# EAGLE design akabeacon_square_type1 (EAGLE 7.2.0)
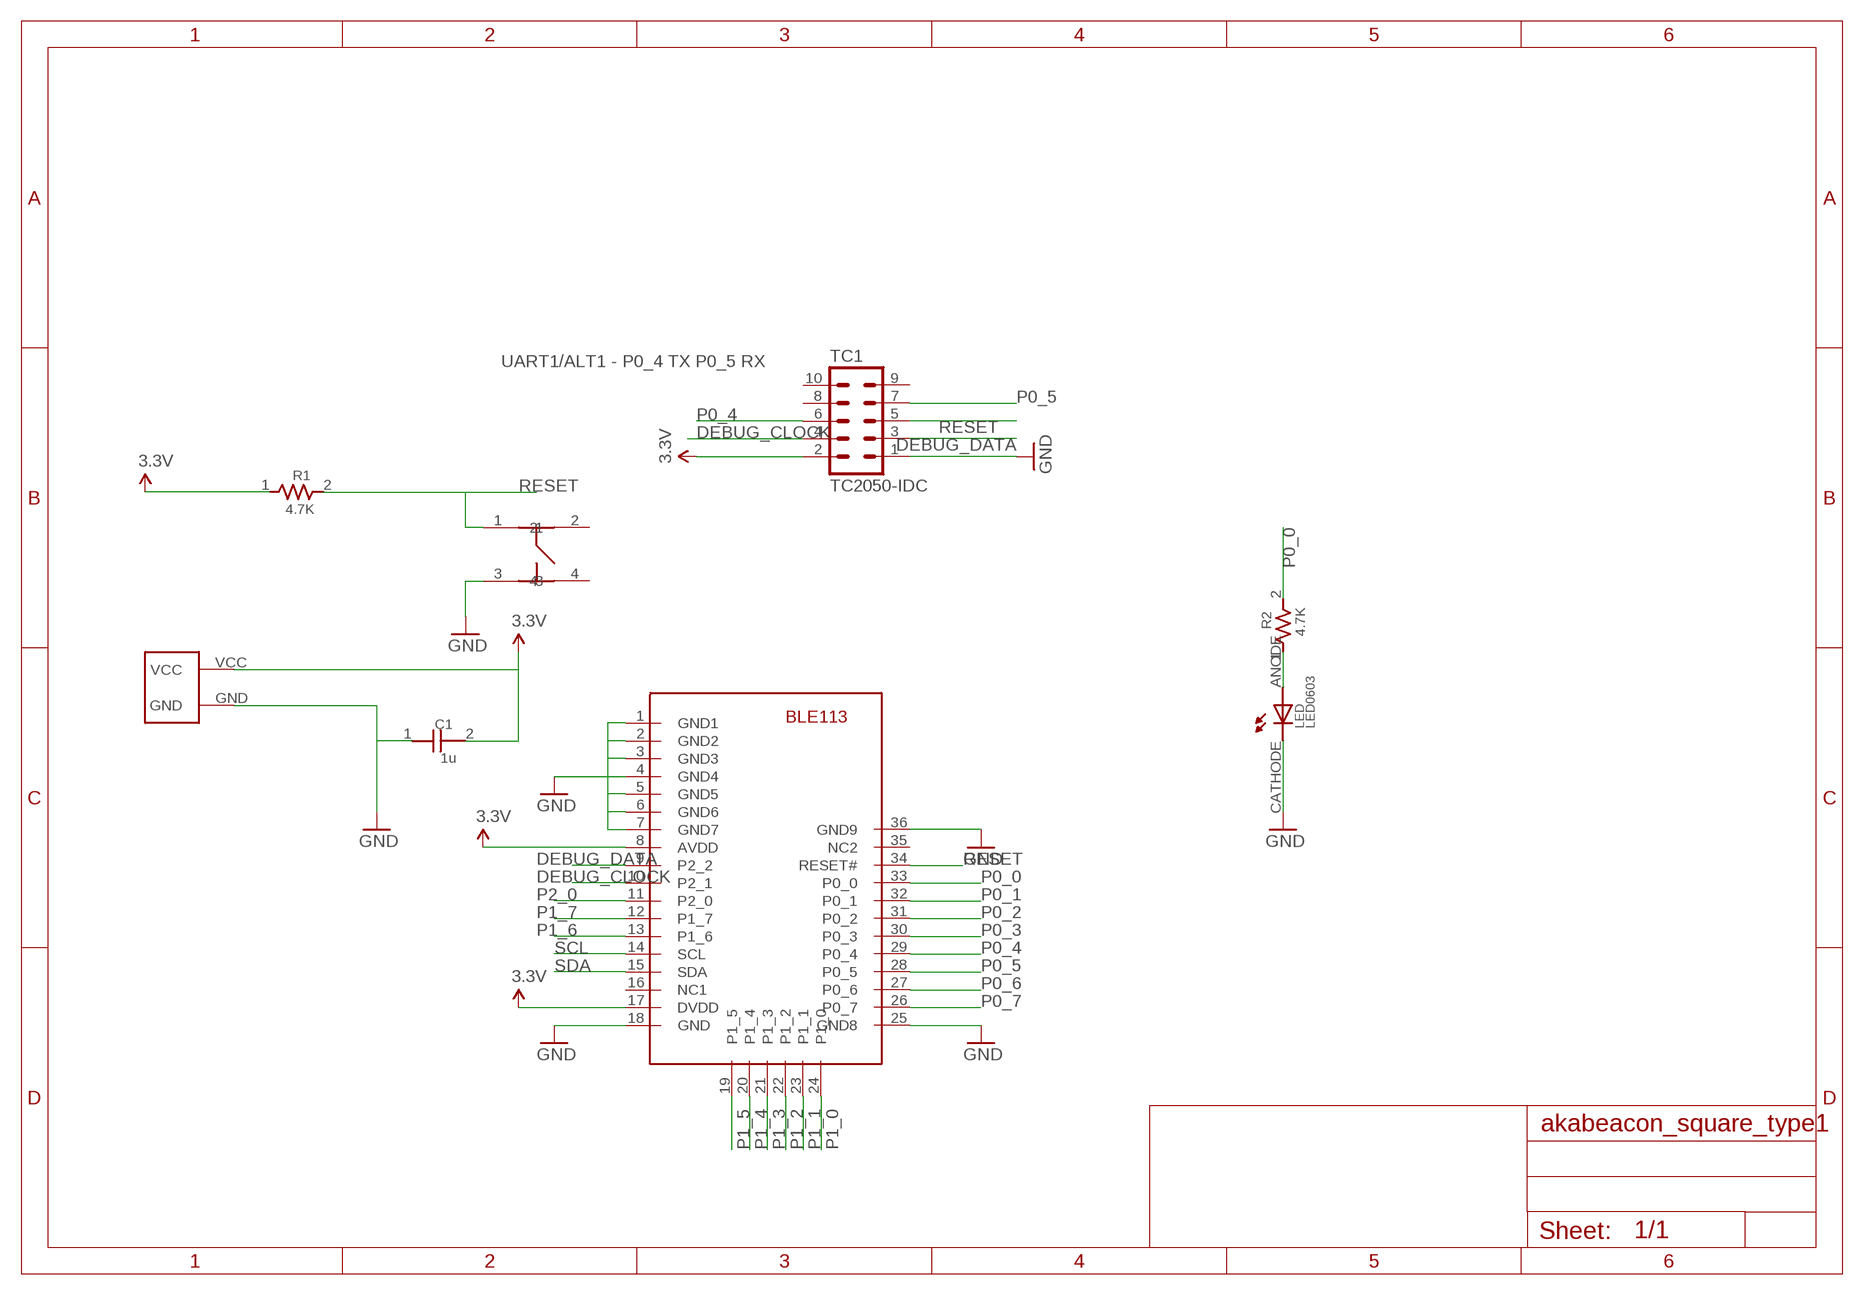
[diagram p0: schematic, sheet 1]

## Parts
C1  1u  CAPACITOR0603  [0603]
LED  LED0603  [0603]
R1  4.7K  RESISTOR0603  [0603]
R2  4.7K  RESISTOR0603  [0603]
TC1  TC2050-IDC  [TC2050-IDC-NL]
U$2  SQUARE-TYPE1  [SQUARE-TYPE1-TC2030]
U$5  BLE113  [BLE113]
U$6  SWICTH-4P(KMR2)  [SWITCH-4P(KMR2)]

## Nets
3.3V: C1.2 R1.1 TC1.2 U$2.VCC U$5.8(AVDD) U$5.17(DVDD)
DEBUG_CLOCK: TC1.4 U$5.10(P2_1)
DEBUG_DATA: TC1.3 U$5.9(P2_2)
GND: C1.1 LED.CATHODE TC1.1 U$2.GND U$5.1(GND1) U$5.2(GND2) U$5.3(GND3) U$5.4(GND4) U$5.5(GND5) U$5.6(GND6) U$5.7(GND7) U$5.18(GND) U$5.25(GND8) U$5.36(GND9) U$6.3
N$2: LED.ANODE R2.1
P0_0: R2.2 U$5.33(P0_0)
P0_1: U$5.32(P0_1)
P0_2: U$5.31(P0_2)
P0_3: U$5.30(P0_3)
P0_4: TC1.6 U$5.29(P0_4)
P0_5: TC1.7 U$5.28(P0_5)
P0_6: U$5.27(P0_6)
P0_7: U$5.26(P0_7)
P1_0: U$5.24(P1_0)
P1_1: U$5.23(P1_1)
P1_2: U$5.22(P1_2)
P1_3: U$5.21(P1_3)
P1_4: U$5.20(P1_4)
P1_5: U$5.19(P1_5)
P1_6: U$5.13(P1_6)
P1_7: U$5.12(P1_7)
P2_0: U$5.11(P2_0)
RESET: R1.2 TC1.5 U$5.34(RESET#) U$6.1
SCL: U$5.14(SCL)
SDA: U$5.15(SDA)
Unconnected: TC1.8 TC1.9 TC1.10 U$5.16(NC1) U$5.35(NC2) U$6.2 U$6.4

## Notes on the sheet
- UART1/ALT1 - P0_4 TX P0_5 RX

## Library data of the parts
C1 = GClue-Capacitor:CAPACITOR
LED = GClue-LED:LED
R1 R2 = GClue-Resistors:RESISTOR
TC1 = TagConnect:TC2050-IDC: Tag-Connect In Circuit Programming & Debug Cable 10 Pin http://www.tag-connect.com
U$2 = GClue-Beacon:SQUARE-TYPE1
U$5 = gclue:BLE113
U$6 = gclue:SWICTH-4P(KMR2)

## Board
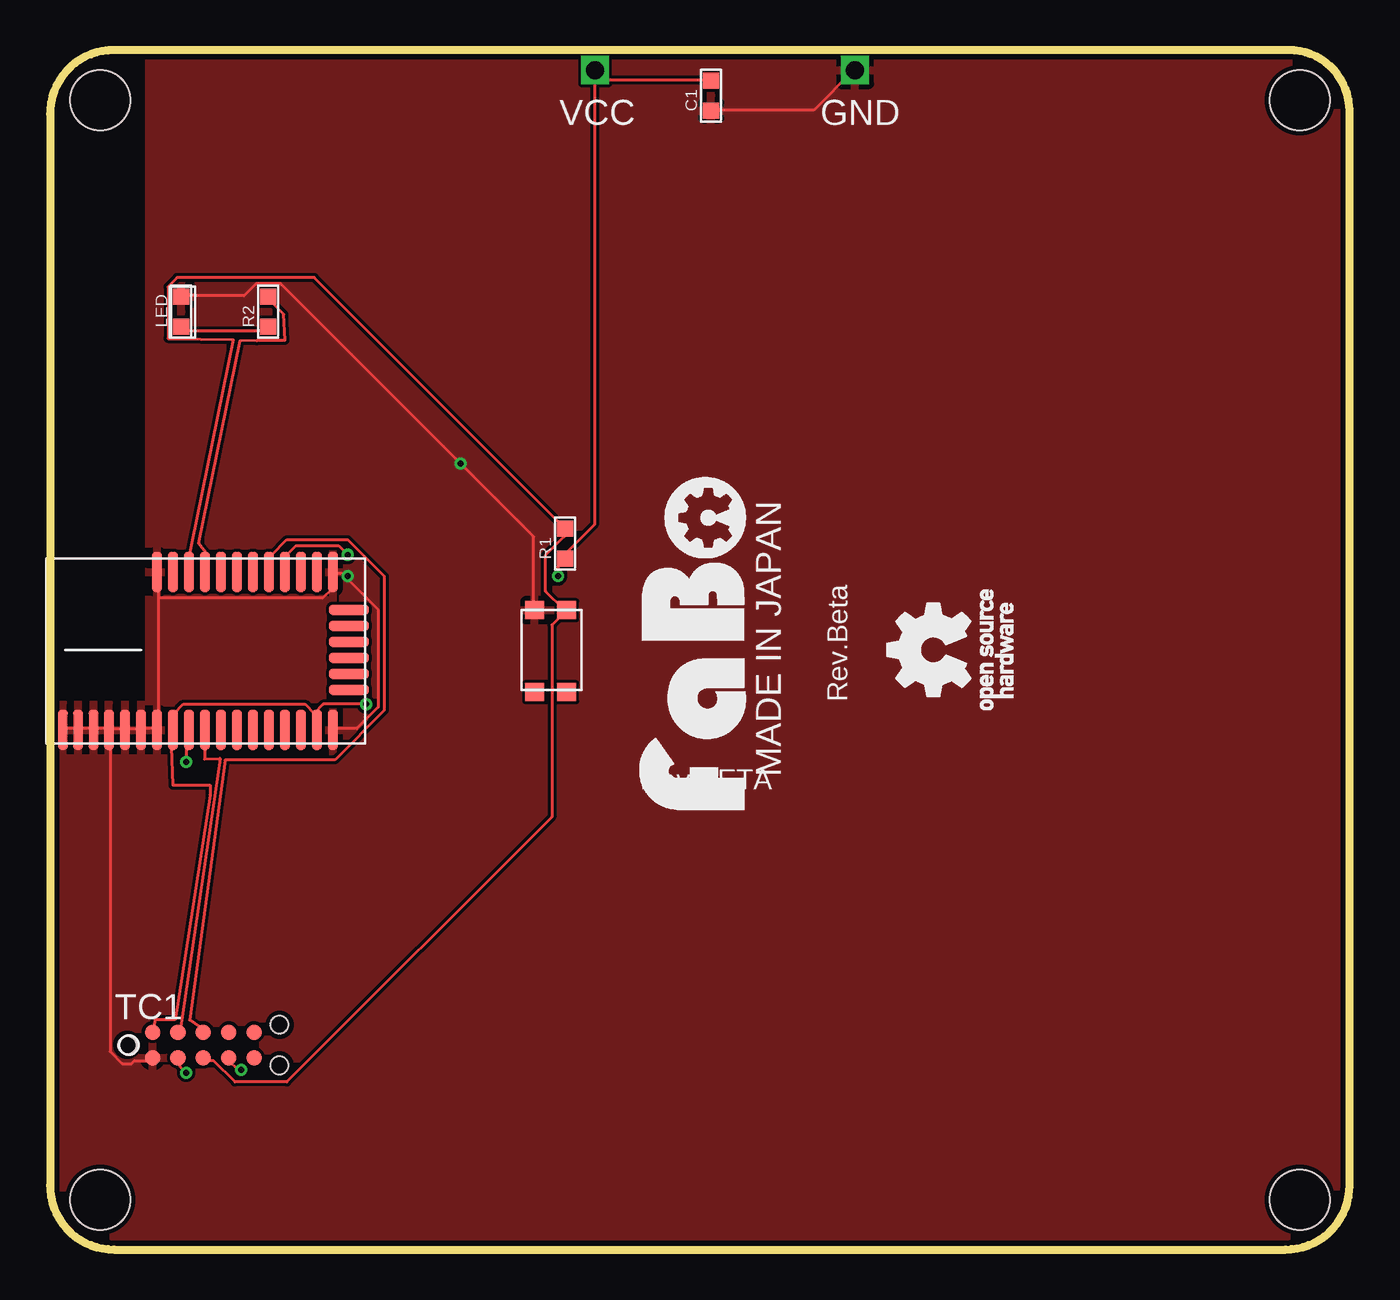
[diagram p1: board, top side]
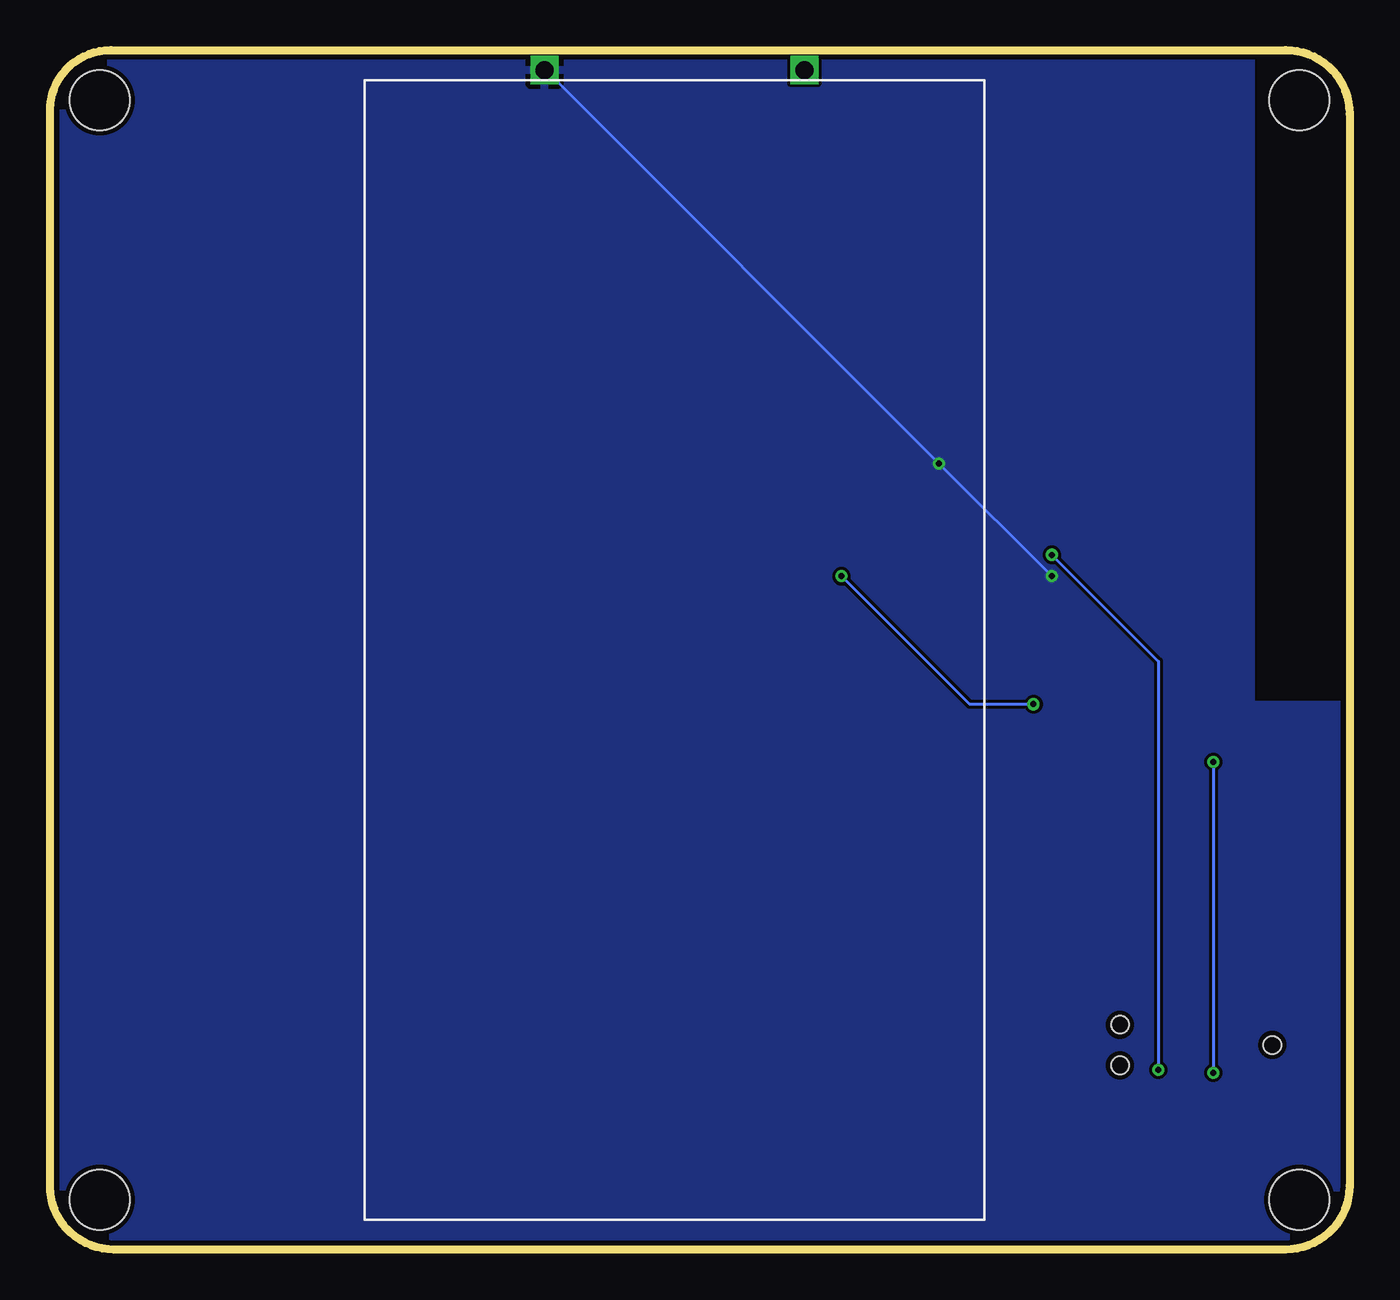
[diagram p2: board, bottom side, seen from below]

Size 65 x 60 mm. Coordinates in mm from the lower left corner, seen from the top.
Copper layers (1*16): Top 0.035mm / dielectric 1.5mm / Bottom 0.035mm
Design rules "SeeedStudio_2layer_DRU_no_angle_20140221": minimum track width 6mil, minimum drill 12mil, track to track 6mil, track to pad 6mil, pad to pad 6mil, via to via 6mil, smd to smd 0mil, copper to edge 10mil, drill to drill 10mil, minimum pad ring 10mil, minimum via ring 6mil, stop-mask expansion 2mil, vias tented up to drill 100mil, thermal gap 10mil
tRestrict: area -1.5,27.5 to 4.7,66
bRestrict: area -1.5,27.5 to 4.7,66

### Footprints (pad centres in the part's own frame; a part is rotated, then mirrored left to right if it is on the bottom)
0603 = smd 0.8 x 0.8: 1 -0.75,0; 2 0.75,0
0603' = smd 0.8 x 0.8: ANODE -0.75,0; CATHODE 0.75,0
TC2050-IDC-NL = smd 0.787 x 0.787: 1 -2.54,-0.635; 2 -2.54,0.635; 3 -1.27,-0.635; 4 -1.27,0.635; 5 0,-0.635; 6 0,0.635; 7 1.27,-0.635; 8 1.27,0.635; 9 2.54,-0.635; 10 2.54,0.635 | hole 0.889: -3.81,0; 3.81,-1.016; 3.81,1.016
SQUARE-TYPE1-TC2030 = drill 0.9 square: GND 7.77,29; VCC -5.23,29 | hole 3: 30.02,27.48; 30.02,-27.52; -29.98,-27.52; -29.98,27.48
BLE113 = smd 2 x 0.5: 1 -5.08,5.08; 2 -5.08,4.31; 3 -5.08,3.54; 4 -5.08,2.77; 5 -5.08,1.97; 6 -5.08,1.17; 7 -5.08,0.37; 8 -5.08,-0.43; 9 -5.08,-1.23; 10 -5.08,-2.03; 11 -5.08,-2.83; 12 -5.08,-3.63; 13 -5.08,-4.43; 14 -5.08,-5.23; 15 -5.08,-6.03; 16 -5.08,-6.83; 17 -5.08,-7.63; 18 -5.08,-8.43; 25 2.82,-8.43; 26 2.82,-7.63; 27 2.82,-6.83; 28 2.82,-6.03; 29 2.82,-5.23; 30 2.82,-4.43; 31 2.82,-3.63; 32 2.82,-2.83; 33 2.82,-2.03; 34 2.82,-1.23; 35 2.82,-0.43; 36 2.82,0.37 | smd 0.5 x 2: 19 -3.08,-9.23; 20 -2.28,-9.23; 21 -1.48,-9.23; 22 -0.68,-9.23; 23 0.12,-9.23; 24 0.92,-9.23
SWITCH-4P(KMR2) = smd 0.9 x 0.95: 1 -1,0; 2 3.1,0; 3 -1,-1.6; 4 3.1,-1.6

### Placement (x,y rotation side)
C1  33.07,57.72 90 top
LED  LED0603  [0603']  6.57,46.91 90 top
R1  25.77,35.31 90 top
R2  10.92,46.91 90 top
TC1  7.67,10.23 0 top
U$2  32.5,30 0 top
U$5  5.72,31.07 90 top
U$6  25.84,30.98 270 top

### Tracks (layer width: path | path; a pad name or v marks a point on that pad's centre or on a via)
3.3V  (via drill 0.3)
  Top 0.152: TC1.2 5.14,10.97 5.25,11.5 6.25,11.5 8,22.75 8,23.23 6.14,23.23 6.05,25.15 6.05,25.91 U$5.8 6.21,26.06 6.21,26.82 6.66,27.28 12.76,27.28 13.22,26.82 | 13.22,26.82 13.22,26.06 U$5.17 13.22,26.82 | 27.24,58.52 27.24,58.98 U$2.VCC 27.24,58.52 | 27.24,58.52 27.24,36.27 25.86,34.9 25.86,34.59 R1.1 25.71,34.44 25.41,34.14 v25.41,33.68 | 27.24,58.52 33.03,58.52 C1.2 | 13.22,26.82 13.67,27.28 v15.81,27.28
  Bottom 0.152: v15.81,27.28 19.01,27.28 v25.41,33.68
DEBUG_CLOCK
  Top 0.152: TC1.4 6.51,10.97 8.51,24.57 7.73,24.54 7.73,25.91 U$5.10
DEBUG_DATA  (via drill 0.3)
  Top 0.152: v6.82,8.84 6.51,9.14 6.51,9.45 TC1.3 | v6.82,24.38 6.82,25.91 U$5.9
  Bottom 0.152: v6.82,24.38 v6.82,8.84
GND  (via drill 0.3)
  Top 0.152: 14.89,33.53 14.59,33.83 14.28,33.83 U$5.25 14.13,33.83 14.13,33.07 13.67,32.61 5.44,32.61 | 14.89,33.53 16.42,32 16.42,27.13 15.35,26.06 14.28,26.06 U$5.18 | 5.44,32.61 5.44,26.06 U$5.7 5.29,26.06 4.68,26.06 U$5.6 4.53,26.06 3.77,26.06 U$5.5 3.62,26.06 3,26.06 U$5.4 | 5.44,32.61 5.44,33.83 U$5.36 | U$5.1 0.72,26.06 1.33,26.06 U$5.2 1.48,26.06 2.09,26.06 U$5.3 2.24,26.06 2.85,26.06 U$5.4 | TC1.1 4.99,9.45 4.22,9.45 4.07,9.3 3.62,9.3 3,9.91 3,25.91 U$5.4 | C1.1 33.18,57 38.21,57 40.19,58.98 U$2.GND | LED.CATHODE 6.66,47.7 9.71,47.7 10.32,48.31 11.54,48.31 v20.53,39.32 24.19,35.66 24.19,32 U$6.3 | v14.89,33.68 14.89,33.53
  Bottom 0.152: U$2.GND 40.19,58.98 v20.53,39.32 v14.89,33.68
  pour Top: -0.5,0 65.5,0 65.5,61 -0.5,61
  pour Bottom: -0.5,0 65.5,0 65.5,61 -0.5,61
N$2
  Top 0.152: LED.ANODE 6.66,45.93 10.78,45.93 R2.1
P0_0
  Top 0.152: 10.35,45.49 9.5,45.45 7.44,35.31 7.88,34.75 7.88,33.98 U$5.33 | 10.35,45.45 10.35,45.49 | 10.35,45.49 11.75,45.49 11.69,46.79 10.93,47.55 R2.2
P0_4
  Top 0.152: TC1.6 7.73,10.97 6.98,11.48 8.75,24.48 14.25,24.5 16.72,26.98 16.72,33.68 14.89,35.51 11.84,35.51 11.08,34.75 11.08,33.98 U$5.29
P0_5  (via drill 0.3)
  Top 0.152: v9.56,8.99 9.41,8.99 8.95,9.45 TC1.7 | v14.89,34.75 14.44,35.2 12.3,35.2 11.84,34.75 11.84,33.98 U$5.28
  Bottom 0.152: v9.56,8.99 9.56,29.41 v14.89,34.75
RESET
  Top 0.152: TC1.5 7.73,9.45 8.19,9.45 9.25,8.38 11.84,8.38 25.1,21.64 25.1,31.24 25.71,31.85 U$6.1 25.71,32 24.8,32.92 24.8,34.75 25.71,35.66 25.71,35.97 R1.2 25.71,36.12 13.22,48.62 6.36,48.62 5.9,48.16 5.9,45.57 9.16,45.5 6.82,33.98 U$5.34

### Text on the board
tPlace: Rev.Beta | Rev.BETA